# EAGLE design BatteryMonitor-12V-LMT2901 (EAGLE 7.2.0)
12V Battery Monitor http://circuitsjunkyard.blogspot.ch/p/blog-page.html http://www.circuitdiagram.org/battery-monitor-using-lm339-ic.html
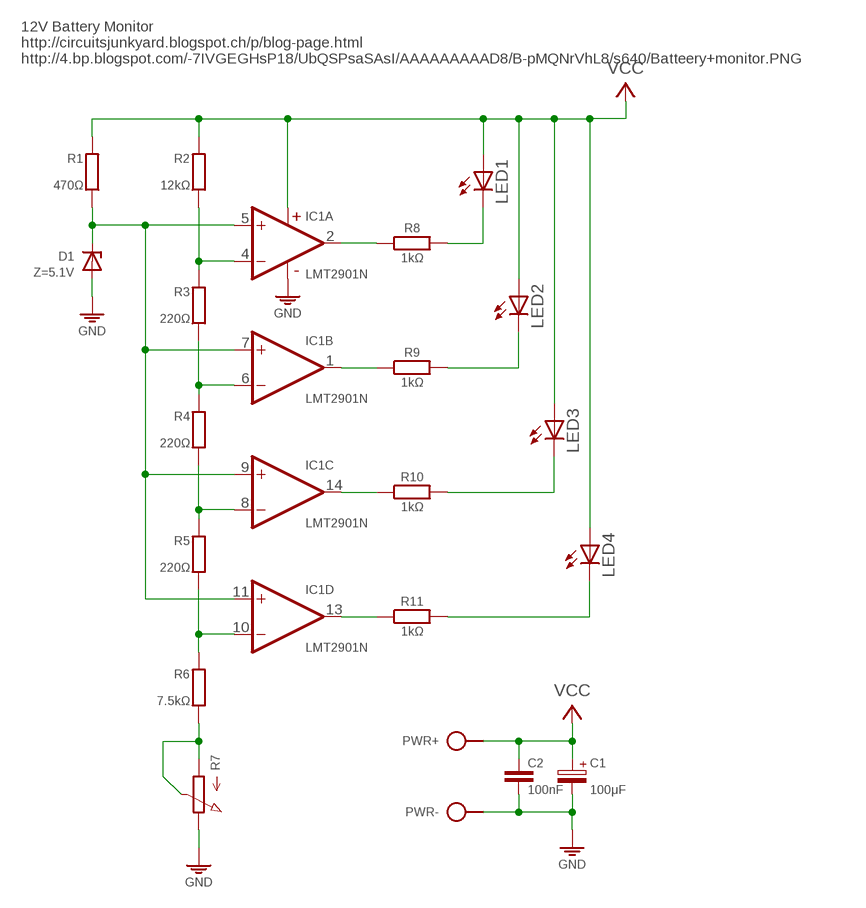
[diagram p0: schematic, sheet 1]

## Parts
C1  100μF  CPOLE2,5-4  [E2,5-4]
C2  100nF  C050-020X044  [C050-020X044]
D1  Z=5.1V  Z-DIODE34Z5V  [DO34Z5V]
IC1  LMT2901N  [DIL14]
LED1  LED3MM  [LED3MM]
LED2  LED3MM  [LED3MM]
LED3  LED3MM  [LED3MM]
LED4  LED3MM  [LED3MM]
PWR  SPAD+-  [SPAD+-]
R1  470Ω  R0204/10  [0204/10]
R2  12kΩ  R0204/10  [0204/10]
R3  220Ω  R0204/10  [0204/10]
R4  220Ω  R0204/10  [0204/10]
R5  220Ω  R0204/10  [0204/10]
R6  7.5kΩ  R0204/10  [0204/10]
R7  POT  [POT]
R8  1kΩ  R-H0204/10  [0204/10]
R9  1kΩ  R-H0204/10  [0204/10]
R10  1kΩ  R-H0204/10  [0204/10]
R11  1kΩ  R-H0204/10  [0204/10]

## Nets
GND: C1.- C2.2 D1.A IC1.12(5:V-) PWR.1 R7.3(E)
N$1: LED4.K(C) R11.2
N$2: LED3.K(C) R10.2
N$3: LED2.K(C) R9.2
N$4: LED1.K(C) R8.2
N$5: IC1.2(A:OUT) R8.1
N$6: IC1.1(B:OUT) R9.1
N$7: IC1.14(C:OUT) R10.1
N$8: IC1.13(D:OUT) R11.1
N$9: D1.C IC1.5(A:+IN) IC1.7(B:+IN) IC1.9(C:+IN) IC1.11(D:+IN) R1.1
N$10: IC1.4(A:-IN) R2.1 R3.2
N$11: IC1.6(B:-IN) R3.1 R4.2
N$12: IC1.8(C:-IN) R4.1 R5.2
N$13: IC1.10(D:-IN) R5.1 R6.2
N$14: R6.1 R7.1(A) R7.2(S)
VCC: C1.+ C2.1 IC1.3(5:V+) LED1.A LED2.A LED3.A LED4.A PWR.2 R1.2 R2.2

## Notes on the sheet
- 12V Battery Monitor
  http://circuitsjunkyard.blogspot.ch/p/blog-page.html
  http://4.bp.blogspot.com/-7IVGEGHsP18/UbQSPsaSAsI/AAAAAAAAAD8/B-pMQNrVhL8/s640/Batteery+monitor.PNG

## Library data of the parts
C1 = c:CPOL: POLARIZED CAPACITOR, European symbol
C2 = c:C: CAPACITOR, European symbol
D1 = d:Z-DIODE
IC1 = ic:LMT2901N
LED1-LED4 = led:LED: LED OSRAM: - CHIPLED LG R971, LG N971, LY N971, LG Q971, LY Q971, LO R971, LY R971 LH N974, LH R974 LS Q976, LO Q976, LY Q976 LO Q996 - Hyper CHIPLED LW Q18S LB Q993, LB Q99A, LB R99A - SideLED LS A670, LO A670, LY A670, LG A670, LP A670 LB A673, LV A673, LT A673, LW A673 LH A674 LY A675 LS A676, LA A676, LO A676, LY A676, LW A676 LS A679, LY A679, LG A679 - Hyper Micro SIDELED@@ LS Y876, LA Y876, LO Y876, LY Y876 LT Y87S - SmartLED LW L88C, LW L88S LB L89C, LB L89S, LG L890 LS L89K, LO L89K, LY L89K LS L896, LA L896, LO L896, LY L896 - TOPLED LS T670, LO T670, LY T670, LG T670, LP T670 LSG T670, LSP T670, LSY T670, LOP T670, LYG T670 LG T671, LOG T671, LSG T671 LB T673, LV T673, LT T673, LW T673 LH T674 LS T676, LA T676, LO T676, LY T676, LB T676, LH T676, LSB T676, LW T676 LB T67C, LV T67C, LT T67C, LS T67K, LO T67K, LY T67K, LW E67C LS E67B, LA E67B, LO E67B, LY E67B, LB E67C, LV E67C, LT E67C LW T67C LS T679, LY T679, LG T679 LS T770, LO T770, LY T770, LG T770, LP T770 LB T773, LV T773, LT T773, LW T773 LH T774 LS E675, LA E675, LY E675, LS T675 LS T776, LA T776, LO T776, LY T776, LB T776 LHGB T686 LT T68C, LB T68C - Hyper Mini TOPLED@@ LB M676 - Mini TOPLED Santana@@ LG M470 LS M47K, LO M47K, LY M47K Source: http://www.osram.convergy.de LUXEON: - LUMILED@@ LXK2-PW12-R00, LXK2-PW12-S00, LXK2-PW14-U00, LXK2-PW14-V00 LXK2-PM12-R00, LXK2-PM12-S00, LXK2-PM14-U00 LXK2-PE12-Q00, LXK2-PE12-R00, LXK2-PE12-S00, LXK2-PE14-T00, LXK2-PE14-U00 LXK2-PB12-K00, LXK2-PB12-L00, LXK2-PB12-M00, LXK2-PB14-N00, LXK2-PB14-P00, LXK2-PB14-Q00 LXK2-PR12-L00, LXK2-PR12-M00, LXK2-PR14-Q00, LXK2-PR14-R00 LXK2-PD12-Q00, LXK2-PD12-R00, LXK2-PD12-S00 LXK2-PH12-R00, LXK2-PH12-S00 LXK2-PL12-P00, LXK2-PL12-Q00, LXK2-PL12-R00 Source: www.luxeon.com KINGBRIGHT: KA-3528ASYC Source: www.kingbright.com
PWR = pad:SPAD+-
R1-R6 = r:R: RESISTOR, European symbol
R7 = r:POT
R8-R11 = r:R-H

## Board
12V Battery Monitor http://circuitsjunkyard.blogspot.ch/p/blog-page.html http://www.circuitdiagram.org/battery-monitor-using-lm339-ic.html
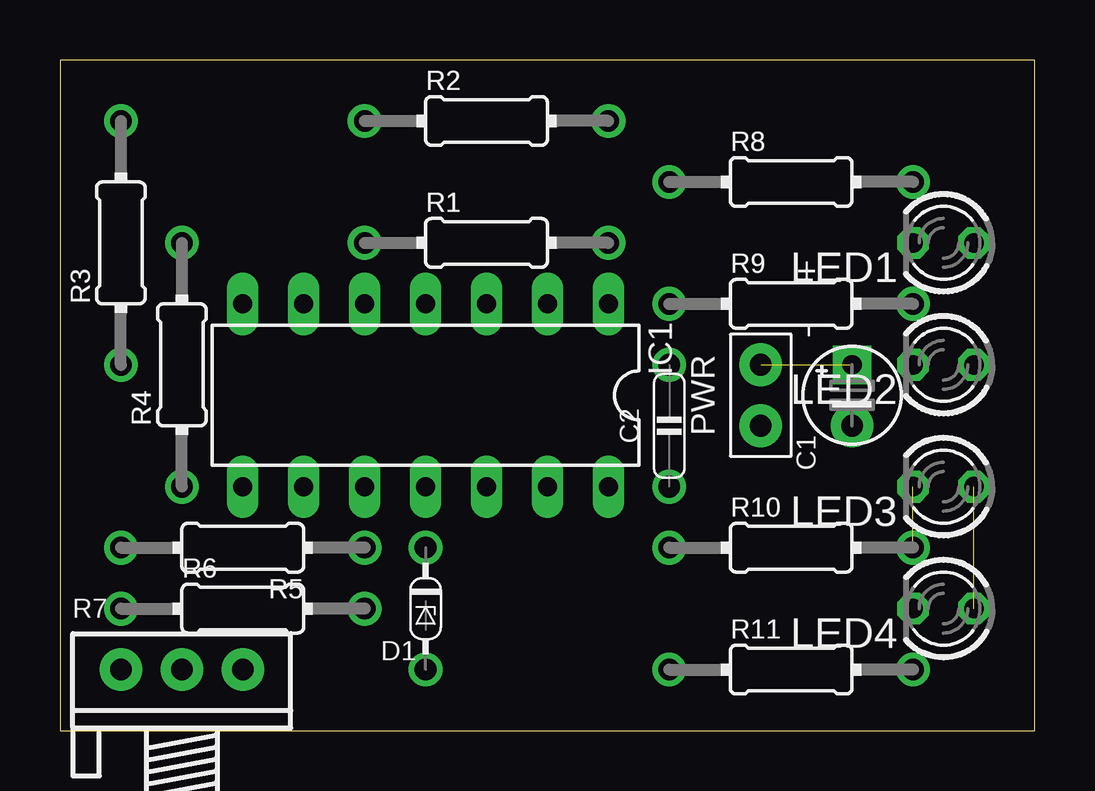
[diagram p1: board, top side]
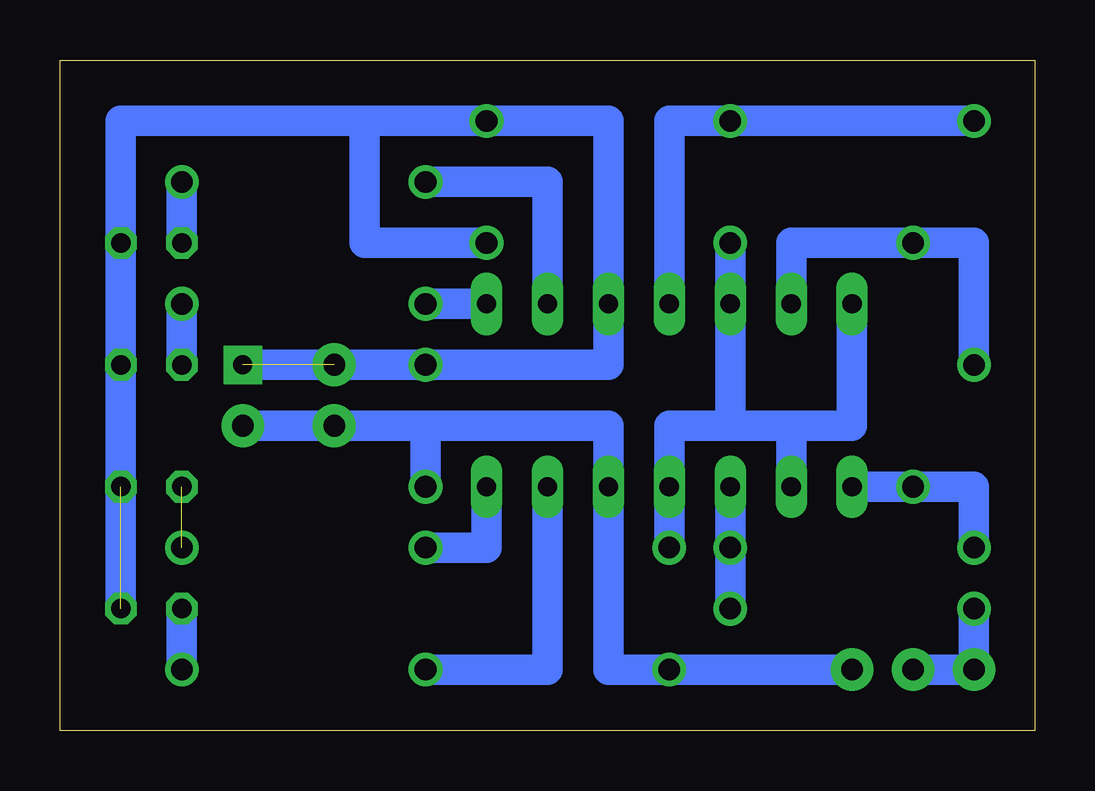
[diagram p2: board, bottom side, seen from below]

Size 40.64 x 27.94 mm. Coordinates in mm from the lower left corner, seen from the top.
Outline: 0,0 40.64,0 40.64,27.94 0,27.94 0,0
Copper layers (1*16): Top 0.035mm / dielectric 1.5mm / Bottom 0.035mm
Design rules "default": minimum track width 10mil, minimum drill 24mil, track to track 8mil, track to pad 8mil, pad to pad 8mil, via to via 8mil, smd to smd 8mil, copper to edge 40mil, drill to drill 8mil, minimum pad ring 10mil, minimum via ring 8mil, stop-mask expansion 4mil, vias tented up to drill 0mil, thermal gap 10mil

### Footprints (pad centres in the part's own frame; a part is rotated, then mirrored left to right if it is on the bottom)
E2,5-4 = drill 0.8 pad 1.6 square: + 0,1.27 | drill 0.9 pad 1.778: - 0,-1.27
C050-020X044 = drill 0.9: 1 2.54,0; 2 -2.54,0
DO34Z5V = drill 0.9: A 0,2.54; C 0,-2.54
DIL14 = drill 0.8 long: 1 -3.81,7.62; 2 -3.81,5.08; 3 -3.81,2.54; 4 -3.81,0; 5 -3.81,-2.54; 6 -3.81,-5.08; 7 -3.81,-7.62; 8 3.81,-7.62; 9 3.81,-5.08; 10 3.81,-2.54; 11 3.81,0; 12 3.81,2.54; 13 3.81,5.08; 14 3.81,7.62
LED3MM = drill 0.813 octagon: A -1.27,0; K 1.27,0
SPAD+- = drill 0.9 pad 1.778: 1 0,-1.27; 2 0,1.27
0204/10 = drill 0.9: 1 -5.08,0; 2 5.08,0
POT = drill 0.9 pad 1.778: 1 -2.54,0; 2 0,0; 3 2.54,0

### Placement (x,y rotation side)
C1  33.02,13.97 0 top
C2  25.4,12.7 90 top
D1  15.24,5.08 180 top
IC1  15.24,13.97 270 top
LED1  36.83,20.32 180 top
LED2  36.83,15.24 180 top
LED3  36.83,10.16 180 top
LED4  36.83,5.08 180 top
PWR  29.21,13.97 0 top
R1  17.78,20.32 0 top
R2  17.78,25.4 0 top
R3  2.54,20.32 90 top
R4  5.08,15.24 90 top
R5  7.62,7.62 180 top
R6  7.62,5.08 0 top
R7  5.08,2.54 0 top
R8  30.48,22.86 0 top
R9  30.48,17.78 0 top
R10  30.48,7.62 0 top
R11  30.48,2.54 0 top

### Tracks (layer width: path | path; a pad name or v marks a point on that pad's centre or on a via)
GND
  Bottom 1.27: R7.3 D1.A 17.78,2.54 IC1.12 17.78,12.7 25.4,12.7 | C2.2 25.4,12.7 | C1.- 25.4,12.7
N$1
  Bottom 1.27: R11.2 LED4.K
N$2  (1 unrouted)
N$3
  Bottom 1.27: R9.2 LED2.K
N$4
  Bottom 1.27: R8.2 LED1.K
N$5
  Bottom 1.27: R8.1 20.32,22.86 IC1.2
N$6
  Bottom 1.27: R9.1 IC1.1
N$7
  Bottom 1.27: R10.1 22.86,7.62 IC1.14
N$8
  Bottom 1.27: IC1.13 20.32,2.54 R11.1
N$9
  Bottom 1.27: 12.7,12.7 IC1.5 R1.1 | 10.16,12.7 7.62,12.7 IC1.7 | 12.7,12.7 10.16,12.7 | 10.16,12.7 IC1.9 | 12.7,12.7 15.24,12.7 IC1.11 D1.C
N$10
  Bottom 1.27: R3.2 R2.1 15.24,25.4 IC1.4
N$11
  Bottom 1.27: IC1.6 10.16,20.32 R4.2 2.54,20.32 R3.1
N$12
  Bottom 1.27: IC1.8 R4.1 2.54,10.16 R5.2
N$13
  Bottom 1.27: IC1.10 R5.1 R6.2
N$14
  Bottom 1.27: R7.2 R7.1 R6.1
VCC  (2 unrouted)
  Bottom 1.27: LED4.A LED2.A LED1.A 38.1,25.4 R2.2 | R2.2 17.78,25.4 IC1.3 17.78,15.24 C2.1 C1.+ | R1.2 27.94,20.32 27.94,25.4 R2.2